# EAGLE schematic S_A_jumper_bed (EAGLE 9.6.2)
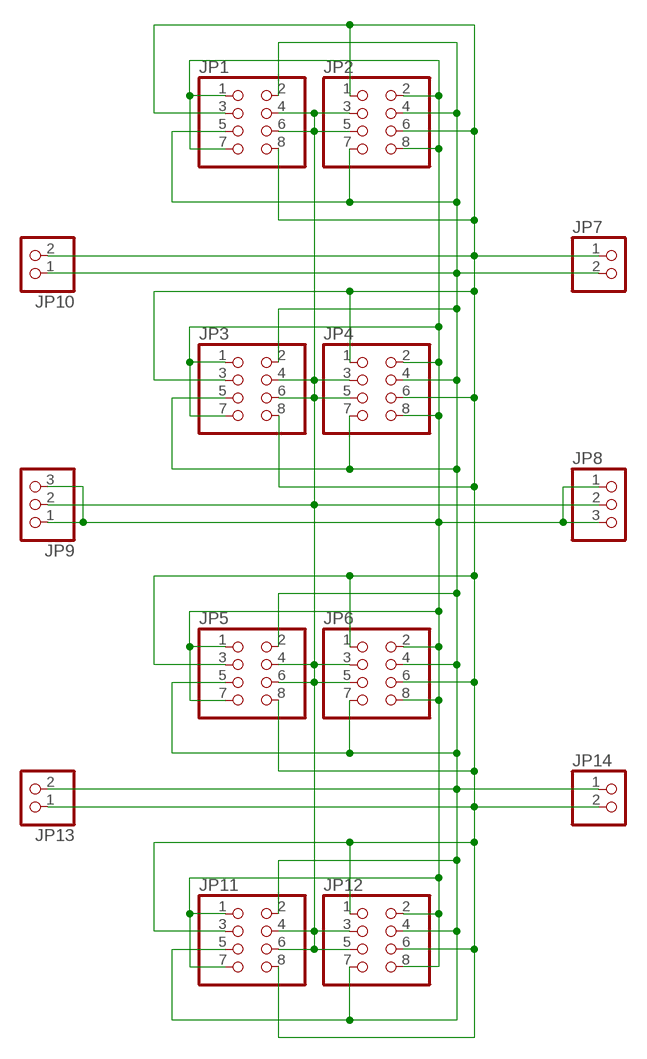
[diagram p0: schematic, sheet 1]

## Parts
JP1  PINHD-2X4  [2X04]
JP2  PINHD-2X4  [2X04]
JP3  PINHD-2X4  [2X04]
JP4  PINHD-2X4  [2X04]
JP5  PINHD-2X4  [2X04]
JP6  PINHD-2X4  [2X04]
JP7  PINHD-1X2/90  [1X02/90]
JP8  PINHD-1X3/90  [1X03/90]
JP9  PINHD-1X31X03/90F  [1X03/90F]
JP10  PINHD-1X21X02/90F  [1X02/90F]
JP11  PINHD-2X4  [2X04]
JP12  PINHD-2X4  [2X04]
JP13  PINHD-1X21X02/90F  [1X02/90F]
JP14  PINHD-1X2/90  [1X02/90]

## Nets
GND: JP1.1 JP1.7 JP2.2 JP2.8 JP3.1 JP3.7 JP4.2 JP4.8 JP5.1 JP5.7 JP6.2 JP6.8 JP8.1 JP8.3 JP9.1 JP9.3 JP11.1 JP11.7 JP12.2 JP12.8
SCL: JP1.2 JP1.5 JP2.4 JP2.7 JP3.2 JP3.5 JP4.4 JP4.7 JP5.2 JP5.5 JP6.4 JP6.7 JP7.2 JP10.1 JP11.2 JP11.5 JP12.4 JP12.7 JP13.2 JP14.1
SDA: JP1.3 JP1.8 JP2.1 JP2.6 JP3.3 JP3.8 JP4.1 JP4.6 JP5.3 JP5.8 JP6.1 JP6.6 JP7.1 JP10.2 JP11.3 JP11.8 JP12.1 JP12.6 JP13.1 JP14.2
VCC: JP1.4 JP1.6 JP2.3 JP2.5 JP3.4 JP3.6 JP4.3 JP4.5 JP5.4 JP5.6 JP6.3 JP6.5 JP8.2 JP9.2 JP11.4 JP11.6 JP12.3 JP12.5

## Library data of the parts
JP1-JP6 JP11 JP12 = pinhead2:PINHD-2X4: PIN HEADER
JP7 JP10 JP13 JP14 = pinhead2:PINHD-1X2: PIN HEADER
JP8 JP9 = pinhead2:PINHD-1X3: PIN HEADER